# Altium schematic sheet osc_evo.SchDoc
size A3
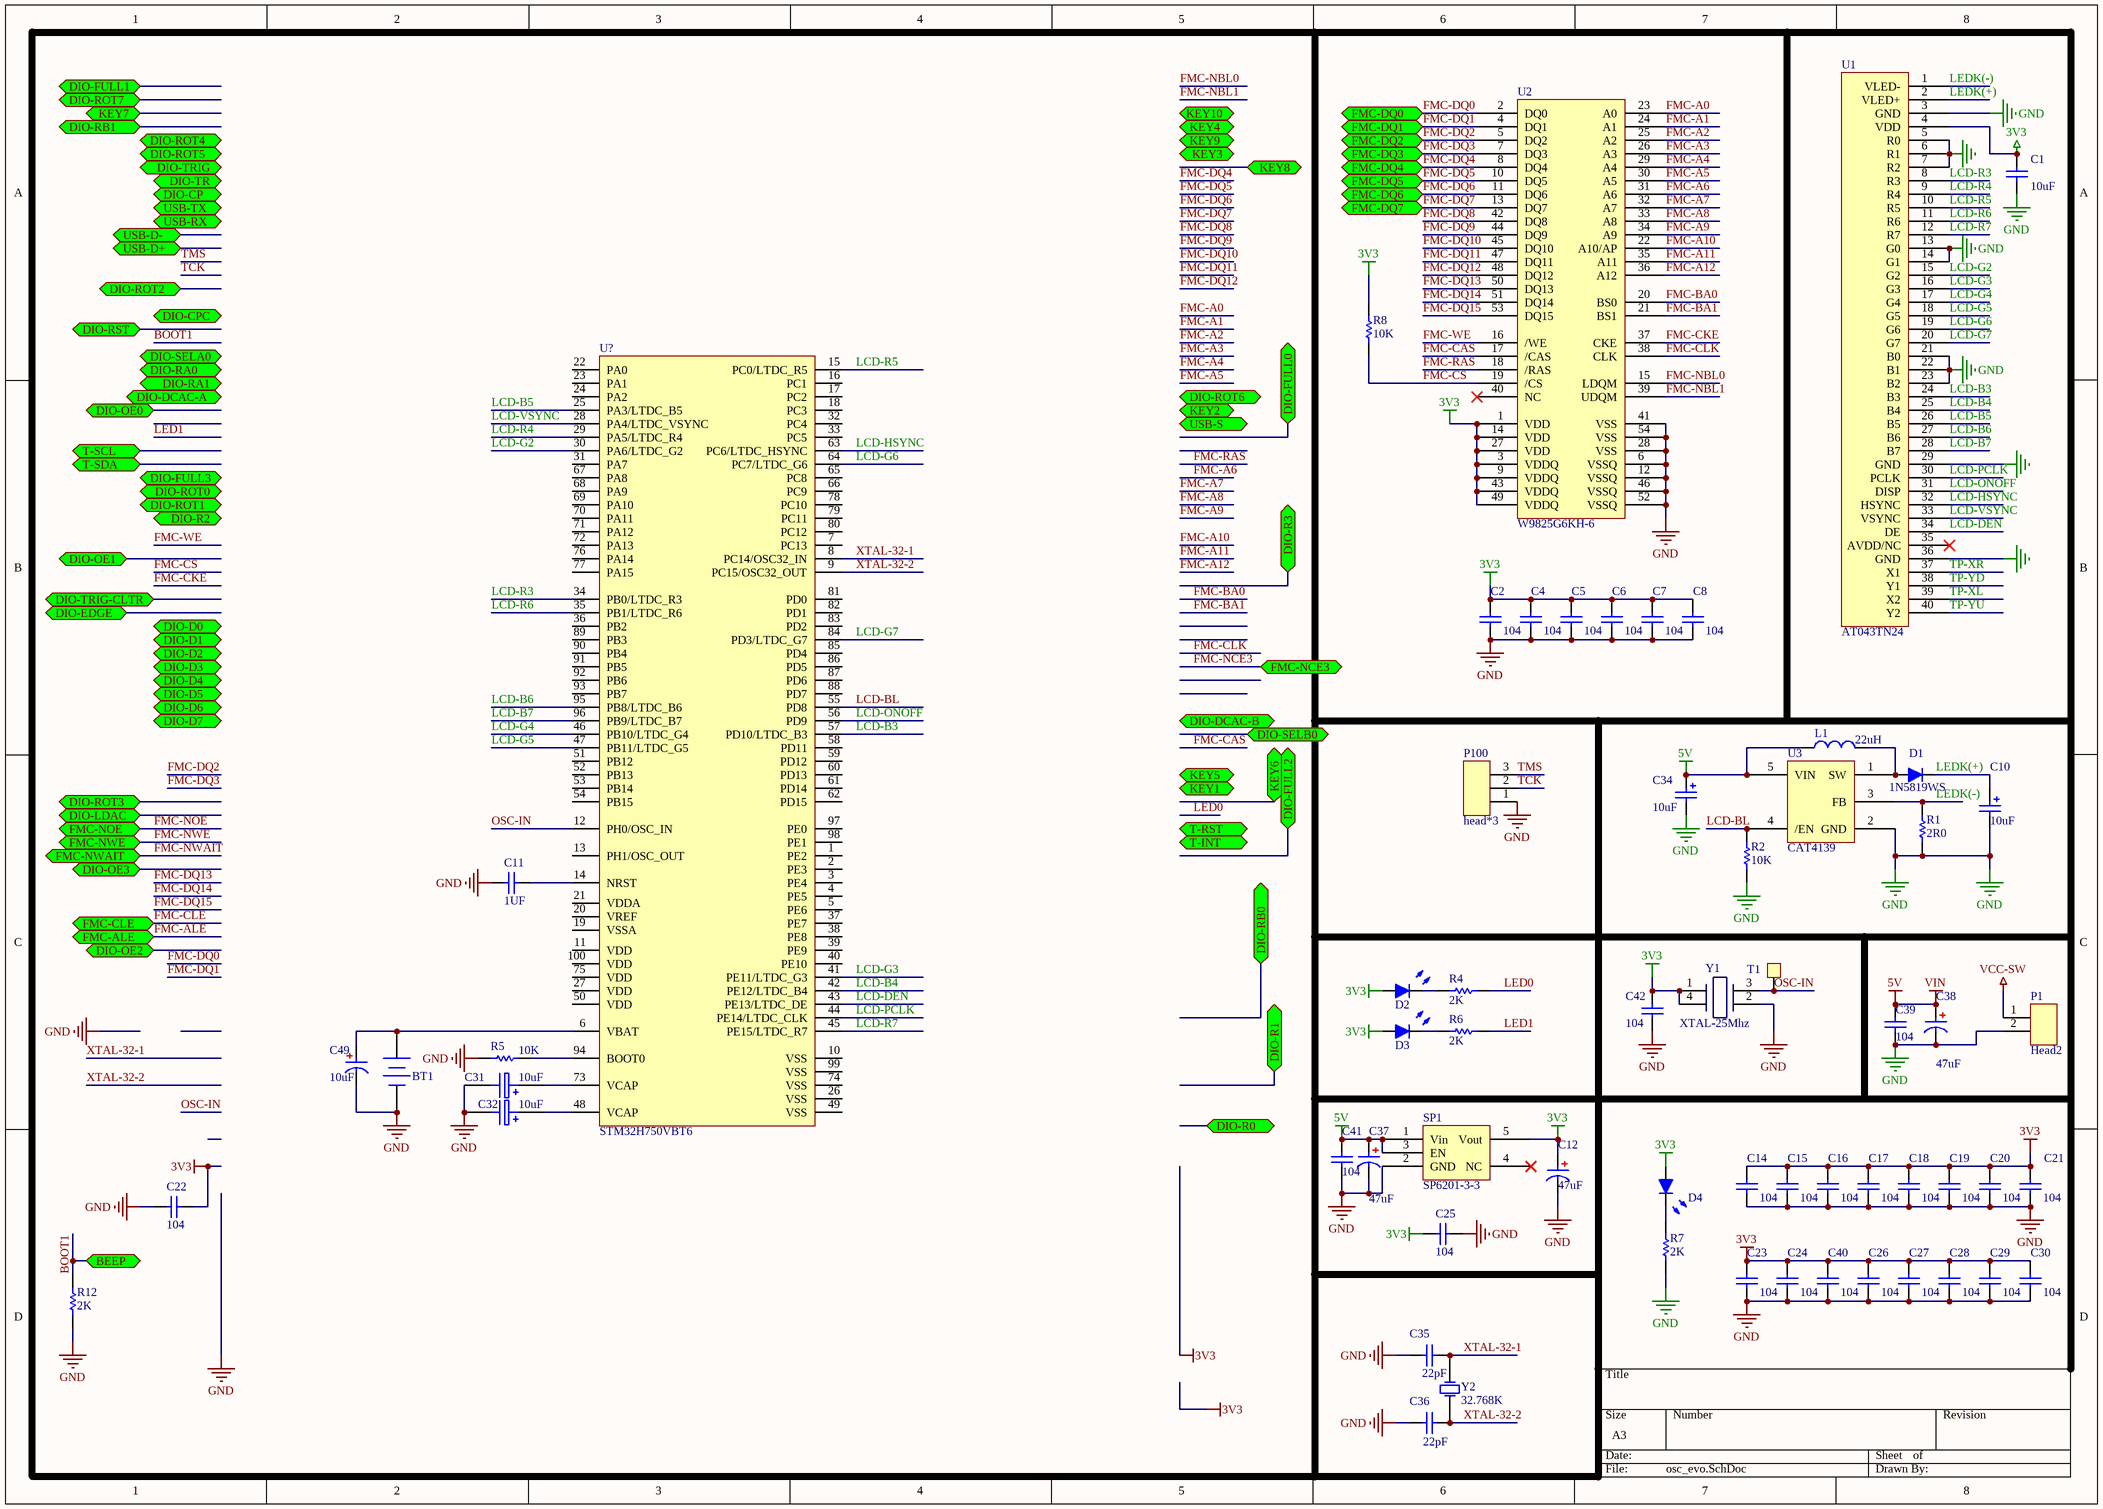
[diagram p0: osc_evo.SchDoc]

## Parts
BT1  Battery  [BAT1]  (value not drawn)
C1  C10uF  [0603C]  (value not drawn)
C2  C0.1uF  [0402]  (value not drawn)
C4  C0.1uF  [0402]  (value not drawn)
C5  C0.1uF  [0402]  (value not drawn)
C6  C0.1uF  [0402]  (value not drawn)
C7  C0.1uF  [0402]  (value not drawn)
C8  C0.1uF  [0402]  (value not drawn)
C10  value 10uF  [0603C]  (hidden comment: C10uF)
C11  C1UF  [0402]  (value not drawn)
C12  47uF  [CAP-T-3216]
C14  C0.1uF  [0402]  (value not drawn)
C15  C0.1uF  [0402]  (value not drawn)
C16  C0.1uF  [0402]  (value not drawn)
C17  C0.1uF  [0402]  (value not drawn)
C18  C0.1uF  [0402]  (value not drawn)
C19  C0.1uF  [0402]  (value not drawn)
C20  C0.1uF  [0402]  (value not drawn)
C21  C0.1uF  [0402]  (value not drawn)
C22  C0.1uF  [0402]  (value not drawn)
C23  C0.1uF  [0402]  (value not drawn)
C24  C0.1uF  [0402]  (value not drawn)
C25  C0.1uF  [0402]  (value not drawn)
C26  C0.1uF  [0402]  (value not drawn)
C27  C0.1uF  [0402]  (value not drawn)
C28  C0.1uF  [0402]  (value not drawn)
C29  C0.1uF  [0402]  (value not drawn)
C30  C0.1uF  [0402]  (value not drawn)
C31  10uF  [0603C]
C32  10uF  [0603C]
C34  value 10uF  [0603C]  (hidden comment: C10uF)
C35  C22pF  [0402]  (value not drawn)
C36  C22pF  [0402]  (value not drawn)
C37  47uF  [CAP-T-3216]
C38  47uF  [CAP-T-3216]
C39  C0.1uF  [0402]  (value not drawn)
C40  C0.1uF  [0402]  (value not drawn)
C41  C0.1uF  [0402]  (value not drawn)
C42  C0.1uF  [0402]  (value not drawn)
C49  C10uF  [0603C]  (value not drawn)
D1  1N5819WS  [SOD23-322F]
D2  LED-B  [LED]  (value not drawn)
D3  LED-G  [LED]  (value not drawn)
D4  LED  [LED]  (value not drawn)
L1  Inductor-22uH  [ins-443]  (value not drawn)
P1  Head2  [HEAD2]
P100  head*3  [head*3 - duplicate]
R1  R8.2  [0603R]  (value not drawn)
R2  R10K  [0402]  (value not drawn)
R4  R2K  [0402]  (value not drawn)
R5  R10K  [0402]  (value not drawn)
R6  R2K  [0402]  (value not drawn)
R7  R2K  [0402]  (value not drawn)
R8  R10K  [0402]  (value not drawn)
R12  R2K  [0402]  (value not drawn)
SP1  SP6201-3-3  [SOT23-5]
T1  TP  [TEST_POINT]  (value not drawn)
U1  AT043TN24  [FPC40-N]
U2  W9825G6KH-6  [TSOP54]
U3  CAT4139  [SOT23-5]
U?  STM32H750VBT6  [LQFP100]
Y1  XTAL-25Mhz  [XTAL3225]
Y2  Y32.768K-3216  [CRY3215-2P]  (value not drawn)

## Ports
BEEP, DIO-CP, DIO-CPC, DIO-D0, DIO-D1, DIO-D2, DIO-D3, DIO-D4, DIO-D5, DIO-D6, DIO-D7, DIO-DCAC-A, DIO-DCAC-B, DIO-EDGE, DIO-FULL0, DIO-FULL1, DIO-FULL2, DIO-FULL3, DIO-LDAC, DIO-OE0, DIO-OE1, DIO-OE2, DIO-OE3, DIO-R0, DIO-R1, DIO-R2, DIO-R3, DIO-RA0, DIO-RA1, DIO-RB0, DIO-RB1, DIO-ROT0, DIO-ROT1, DIO-ROT2, DIO-ROT3, DIO-ROT4, DIO-ROT5, DIO-ROT6, DIO-ROT7, DIO-RST, DIO-SELA0, DIO-SELB0, DIO-TR, DIO-TRIG, DIO-TRIG-CLTR, FMC-ALE, FMC-CLE, FMC-DQ0, FMC-DQ1, FMC-DQ2, FMC-DQ3, FMC-DQ4, FMC-DQ5, FMC-DQ6, FMC-DQ7, FMC-NCE3, FMC-NOE, FMC-NWAIT, FMC-NWE, KEY1, KEY2, KEY3, KEY4, KEY5, KEY6, KEY7, KEY8, KEY9, KEY10, T-INT, T-RST, T-SCL, T-SDA, USB-D+, USB-D-, USB-RX, USB-S, USB-TX

## Nets
3V3: C1.1 C2.1 C4.1 C5.1 C6.1 C7.1 C8.1 C12.1 C14.1 C15.1 C16.1 C17.1 C18.1 C19.1 C20.1 C21.1 C22.1 C23.1 C24.1 C25.1 C26.1 C27.1 C28.1 C29.1 C30.1 C40.1 C42.2 D2.1(A) D3.1(A) D4.1(A) R8.2 SP1.5(Vout) U1.4(VDD) U2.1(VDD) U2.3(VDDQ) U2.9(VDDQ) U2.14(VDD) U2.27(VDD) U2.43(VDDQ) U2.49(VDDQ) Y1.1 Y1.4
5V: C34.1 C37.1 C38.1 C39.1 C41.2 L1.1 SP1.1(Vin) SP1.3(EN) U3.5(VIN)  [also labelled VIN]
GND: BT1.2(-) C1.2 C2.2 C4.2 C5.2 C6.2 C7.2 C8.2 C10.2 C11.2 C12.2 C14.2 C15.2 C16.2 C17.2 C18.2 C19.2 C20.2 C21.2 C22.2 C23.2 C24.2 C25.2 C26.2 C27.2 C28.2 C29.2 C30.2 C31.2 C32.2 C34.2 C35.1 C36.1 C37.2 C38.2 C39.2 C40.2 C41.1 C42.1 C49.2 P1.2 P100.1 R1.2 R2.1 R5.2 R7.2 R12.1 SP1.2(GND) U1.3(GND) U1.5(R0) U1.6(R1) U1.7(R2) U1.13(G0) U1.14(G1) U1.21(B0) U1.22(B1) U1.23(B2) U1.29(GND) U1.36(GND) U2.6(VSSQ) U2.12(VSSQ) U2.28(VSS) U2.41(VSS) U2.46(VSSQ) U2.52(VSSQ) U2.54(VSS) U3.2(GND) Y1.2
VCC-SW: P1.1
BOOT1: R12.2 ; port BEEP
FMC-A0: U2.23(A0)
FMC-A1: U2.24(A1)
FMC-A2: U2.25(A2)
FMC-A3: U2.26(A3)
FMC-A4: U2.29(A4)
FMC-A5: U2.30(A5)
FMC-A6: U2.31(A6)
FMC-A7: U2.32(A7)
FMC-A8: U2.33(A8)
FMC-A9: U2.34(A9)
FMC-A10: U2.22(A10/AP)
FMC-A11: U2.35(A11)
FMC-A12: U2.36(A12)
FMC-ALE: port FMC-ALE
FMC-BA0: U2.20(BS0)
FMC-BA1: U2.21(BS1)
FMC-CAS: U2.17(/CAS)
FMC-CKE: U2.37(CKE)
FMC-CLE: port FMC-CLE
FMC-CLK: U2.38(CLK)
FMC-CS: R8.1 U2.19(/CS)
FMC-DQ0: U2.2(DQ0) ; port FMC-DQ0
FMC-DQ1: U2.4(DQ1) ; port FMC-DQ1
FMC-DQ2: U2.5(DQ2) ; port FMC-DQ2
FMC-DQ3: U2.7(DQ3) ; port FMC-DQ3
FMC-DQ4: U2.8(DQ4) ; port FMC-DQ4
FMC-DQ5: U2.10(DQ5) ; port FMC-DQ5
FMC-DQ6: U2.11(DQ6) ; port FMC-DQ6
FMC-DQ7: U2.13(DQ7) ; port FMC-DQ7
FMC-DQ8: U2.42(DQ8)
FMC-DQ9: U2.44(DQ9)
FMC-DQ10: U2.45(DQ10)
FMC-DQ11: U2.47(DQ11)
FMC-DQ12: U2.48(DQ12)
FMC-DQ13: U2.50(DQ13)
FMC-DQ14: U2.51(DQ14)
FMC-DQ15: U2.53(DQ15)
FMC-NBL0: U2.15(LDQM)
FMC-NBL1: U2.39(UDQM)
FMC-NCE3: port FMC-NCE3
FMC-NOE: port FMC-NOE
FMC-NWAIT: port FMC-NWAIT
FMC-NWE: port FMC-NWE
FMC-RAS: U2.18(/RAS)
FMC-WE: U2.16(/WE)
LCD-B3: U1.24(B3) U?.57(PD10/LTDC_B3)
LCD-B4: U1.25(B4) U?.42(PE12/LTDC_B4)
LCD-B5: U1.26(B5) U?.25(PA3/LTDC_B5)
LCD-B6: U1.27(B6) U?.95(PB8/LTDC_B6)
LCD-B7: U1.28(B7) U?.96(PB9/LTDC_B7)
LCD-BL: R2.2 U3.4(/EN) U?.55(PD8)
LCD-DEN: U1.34(DE) U?.43(PE13/LTDC_DE)
LCD-G2: U1.15(G2) U?.30(PA6/LTDC_G2)
LCD-G3: U1.16(G3) U?.41(PE11/LTDC_G3)
LCD-G4: U1.17(G4) U?.46(PB10/LTDC_G4)
LCD-G5: U1.18(G5) U?.47(PB11/LTDC_G5)
LCD-G6: U1.19(G6) U?.64(PC7/LTDC_G6)
LCD-G7: U1.20(G7) U?.84(PD3/LTDC_G7)
LCD-HSYNC: U1.32(HSYNC) U?.63(PC6/LTDC_HSYNC)
LCD-ONOFF: U1.31(DISP) U?.56(PD9)
LCD-PCLK: U1.30(PCLK) U?.44(PE14/LTDC_CLK)
LCD-R3: U1.8(R3) U?.34(PB0/LTDC_R3)
LCD-R4: U1.9(R4) U?.29(PA5/LTDC_R4)
LCD-R5: U1.10(R5) U?.15(PC0/LTDC_R5)
LCD-R6: U1.11(R6) U?.35(PB1/LTDC_R6)
LCD-R7: U1.12(R7) U?.45(PE15/LTDC_R7)
LCD-VSYNC: U1.33(VSYNC) U?.28(PA4/LTDC_VSYNC)
LED0: R4.2
LED1: R6.2
LEDK(+): C10.1 D1.2(K) U1.2(VLED+)
LEDK(-): R1.1 U1.1(VLED-) U3.3(FB)
OSC-IN: T1.1(R) U?.12(PH0/OSC_IN) Y1.3
TCK: P100.2
TMS: P100.3
TP-XL: U1.39(X2)
TP-XR: U1.37(X1)
TP-YD: U1.38(Y1)
TP-YU: U1.40(Y2)
XTAL-32-1: C35.2 U?.8(PC14/OSC32_IN) Y2.2(OSC2)
XTAL-32-2: C36.2 U?.9(PC15/OSC32_OUT) Y2.1(OSC1)
NetBT1_1: BT1.1(+) C49.1 U?.6(VBAT)
NetC11_1: C11.1 U?.14(NRST)
NetC31_1: C31.1 U?.73(VCAP)
NetC32_1: C32.1 U?.48(VCAP)
NetD1_1: D1.1(A) L1.2 U3.1(SW)
NetD2_2: D2.2(K) R4.1
NetD3_2: D3.2(K) R6.1
NetD4_2: D4.2(K) R7.1
NetR5_1: R5.1 U?.94(BOOT0)

Not connected (* = marked no-connect by the designer): SP1 4(NC)*; U1 35(AVDD/NC)*; U2 40(NC)*; U? 1(PE2) 2(PE3) 3(PE4) 4(PE5) 5(PE6) 7(PC13) 10(VSS) 11(VDD) 13(PH1/OSC_OUT) 16(PC1) 17(PC2) 18(PC3) 19(VSSA) 20(VREF) 21(VDDA) 22(PA0) 23(PA1) 24(PA2) 26(VSS) 27(VDD) 31(PA7) 32(PC4) 33(PC5) 36(PB2) 37(PE7) 38(PE8) 39(PE9) 40(PE10) 49(VSS) 50(VDD) 51(PB12) 52(PB13) 53(PB14) 54(PB15) 58(PD11) 59(PD12) 60(PD13) 61(PD14) 62(PD15) 65(PC8) 66(PC9) 67(PA8) 68(PA9) 69(PA10) 70(PA11) 71(PA12) 72(PA13) 74(VSS) 75(VDD) 76(PA14) 77(PA15) 78(PC10) 79(PC11) 80(PC12) 81(PD0) 82(PD1) 83(PD2) 85(PD4) 86(PD5) 87(PD6) 88(PD7) 89(PB3) 90(PB4) 91(PB5) 92(PB6) 93(PB7) 97(PE0) 98(PE1) 99(VSS) 100(VDD)

## Notes on the sheet
- (in symbol C0.1uF) 1UF; 104
- (in symbol C10uF) 10uF
- (in symbol C10uF-B) 10uF
- (in symbol C22pF) 22pF
- (in symbol Inductor-100uH) 22uH
- (in symbol R2K) 2K
- (in symbol R8.2) 2R0
- (in symbol R10K) 10K
- (in symbol Y32.768K) 32.768K

## Library data of the parts
BT1 = Battery: Multicell Battery; Published: 24-Mar-1999; Revision: July-2002: Re-released for DXP Platform.; Publisher: Altium Limited
C1 = C10uF-B
C10 C34 = Cap Pol1: Polarized Capacitor (Radial); Published: 8-Jun-2000; Revision: July-2002: Re-released for DXP Platform.; Publisher: Altium Limited
C11 = C0.1uF
C12 C37 C38 = C10uF: 贴片电容
C31 C32 = ELECTRO1: Electrolytic Capacitor
D1 = Diode
D2 D3 = LED
L1 = Inductor-100uH
SP1 = SP6201
Y1 = XTAL-100Mhz
Y2 = Y32.768K